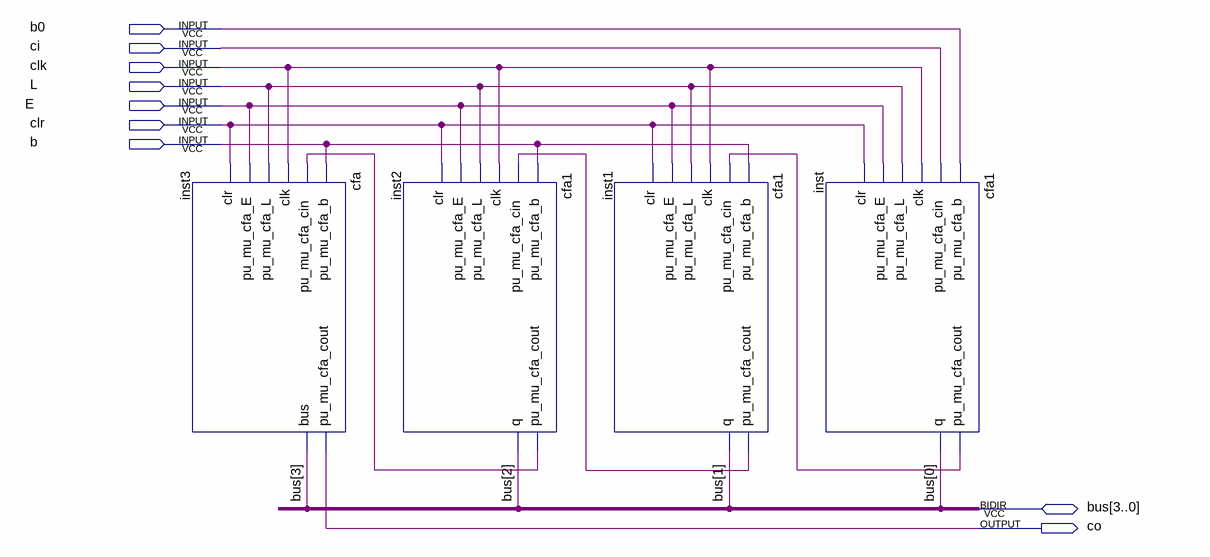
[diagram p0: schematic sheet]
// Quartus schematic dzh01.bdf as structural Verilog: 4 symbols, 9 pins
module dzh01 (
  input  b0,
  input  ci,
  input  clk,
  input  L,
  input  E,
  input  clr,
  input  b,
  inout  [3:0] bus,
  output co
);

  wire inst1_pu_mu_cfa_cout, inst2_pu_mu_cfa_cout, inst_pu_mu_cfa_cout;

  cfa inst3 (
    .pu_mu_cfa_b(b), .pu_mu_cfa_cin(inst2_pu_mu_cfa_cout), .clk(clk), .pu_mu_cfa_L(L), .pu_mu_cfa_E(E),
    .clr(clr), .pu_mu_cfa_cout(co), .bus(bus[3]));
  cfa1 inst2 (
    .pu_mu_cfa_b(b), .pu_mu_cfa_cin(inst1_pu_mu_cfa_cout), .clk(clk), .pu_mu_cfa_L(L), .pu_mu_cfa_E(E),
    .clr(clr), .pu_mu_cfa_cout(inst2_pu_mu_cfa_cout), .q(bus[2]));
  cfa1 inst1 (
    .pu_mu_cfa_b(b), .pu_mu_cfa_cin(inst_pu_mu_cfa_cout), .clk(clk), .pu_mu_cfa_L(L), .pu_mu_cfa_E(E),
    .clr(clr), .pu_mu_cfa_cout(inst1_pu_mu_cfa_cout), .q(bus[1]));
  cfa1 inst (
    .pu_mu_cfa_b(b0), .pu_mu_cfa_cin(ci), .clk(clk), .pu_mu_cfa_L(L), .pu_mu_cfa_E(E), .clr(clr),
    .pu_mu_cfa_cout(inst_pu_mu_cfa_cout), .q(bus[0]));
endmodule
